# Altium project Assignment1.PrjPcb
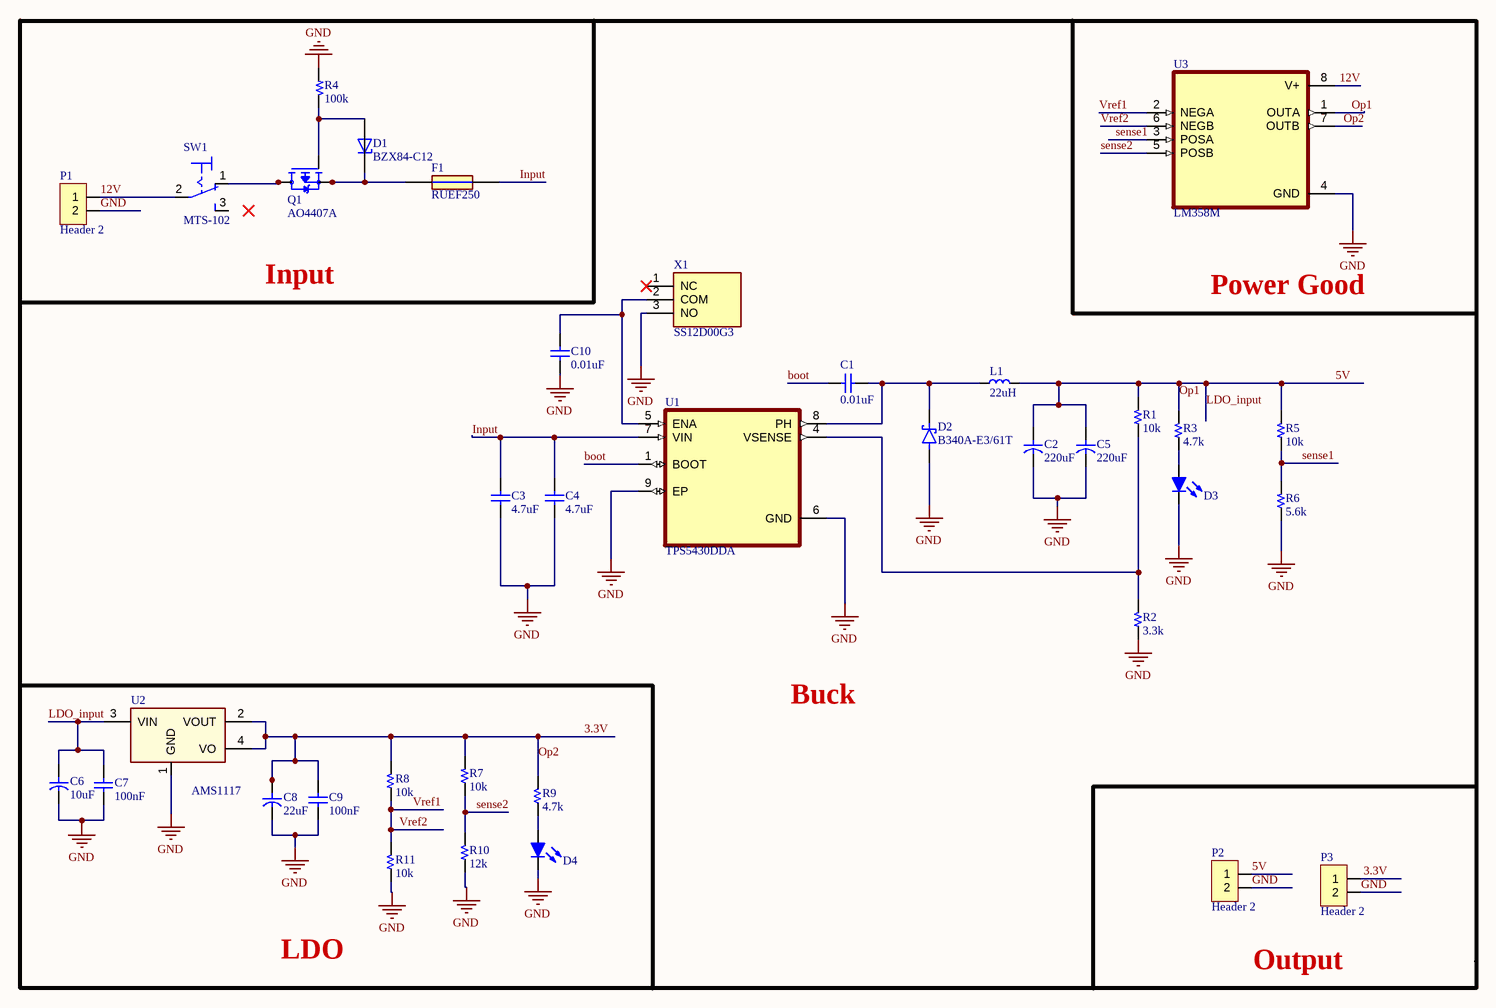
[diagram p0: Assignment1.SchDoc]
1 sheet, 36 parts. Net scope: global (net labels, ports and power ports of the same name join across sheets).
Board file: Assignment1.PcbDoc

## Sheet Assignment1.SchDoc
size 420 x 297 mm; SheetNumber: 1; SheetTotal: 1

### Parts
C1  0.01uF  [C 0805]
C2  220uF  [C SMD TAN 2917 (E)]
C3  4.7uF  [C 0805]
C4  4.7uF  [C 0805]
C5  220uF  [C SMD TAN 2917 (E)]
C6  10uF  [C SMD ALU (B)]
C7  100nF  [C 0805]
C8  22uF  [C SMD TAN 2917 (E)]
C9  100nF  [C 0805]
C10  0.01uF  [C 0805]
D1  BZX84-C12  [SOT95P230X110-3N]
D2  B340A-E3/61T  [DIOM5126X229N]
D3  Led  [LED 3MM - green]  (value not drawn)
D4  Led  [LED 3MM - green]  (value not drawn)
F1  RUEF250  [RUEF250]
L1  22uH  [Inductor SMD 12x12x8]
P1  Header 2  [HDR/Terminal/2]
P2  Header 2  [HDR/Terminal/2]
P3  Header 2  [HDR/Terminal/2]
Q1  AO4407A  [SOIC127P600X175-8N]
R1  10k  [R 1206]
R2  3.3k  [R 1206]
R3  4.7k  [R 1206]
R4  100k  [R 1206]
R5  10k  [R 1206]
R6  5.6k  [R 1206]
R7  10k  [R 1206]
R8  10k  [R 1206]
R9  4.7k  [R 1206]
R10  12k  [R 1206]
R11  10k  [R 1206]
SW1  MTS-102  [MTS-102]
U1  TPS5430DDA  [VREG_LM5017MR/NOPB]
U2  AMS1117  [SOT-223]
U3  LM358M  [SOIC127P599X175-8N]
X1  SS12D00G3  [SS12D00G3]

### Nets
GND: C2.2 C3.2 C4.2 C5.2 C6.2 C7.2 C8.2 C9.2 C10.1 D2.A D3.2(K) D4.2(K) P1.2 P2.2 P3.2 R2.1 R4.1 R6.1 R10.1 R11.1 U1.6(GND) U1.9(EP) U2.1(GND) U3.4(GND) X1.3(NO)
3.3V: C8.1 C9.1 P3.1 R7.2 R8.2 R9.2 U2.2(VOUT) U2.4(VO) U3.7(OUTB)  [also labelled Op2]
5V: C2.1 C5.1 C6.1 C7.1 L1.2 P2.1 R1.2 R3.2 R5.2 U2.3(VIN) U3.1(OUTA)  [also labelled LDO_input, Op1]
12V: P1.1 SW1.2(P) U3.8(V+)
boot: C1.1 U1.1(BOOT)
Input: C3.1 C4.1 F1.2 U1.7(VIN)
sense1: R5.1 R6.2 U3.3(POSA)
sense2: R7.1 R10.2 U3.5(POSB)
Vref1: R8.1 R11.2 U3.2(NEGA) U3.6(NEGB)  [also labelled Vref2]
NetC1_2: C1.2 D2.C L1.1 U1.8(PH)
NetC10_2: C10.2 U1.5(ENA) X1.2(COM)
NetD1_1: D1.1(A) Q1.4(G) R4.2
NetD1_3: D1.3(C) F1.1 Q1.1(S) Q1.2(S) Q1.3(S)
NetD3_1: D3.1(A) R3.1
NetD4_1: D4.1(A) R9.1
NetQ1_5: Q1.5(D) Q1.6(D) Q1.7(D) Q1.8(D) SW1.1(O)
NetR1_1: R1.1 R2.2 U1.4(VSENSE)

Not connected (* = marked no-connect by the designer): SW1 3(S); X1 1(NC)*

### Notes on the sheet
- Input
- Power Good
- Buck
- LDO
- Output
- THIS DOCUMENT AND THE DATA DISCLOSED HEREIN OR
- HEREWITH IS THE PROPERTY OF ALTIUM LIMITED AND MAY
- DWG NO:
- REVISION
- REV:
- DESCRIPTION
- DATE
- APPROVED
- BE FREELY DISTRIBUTED IN WHOLE. NO RIGHTS ARE
- RESERVED OR EXPRESS OR IMPLIED WARANTEE GIVEN.
- ENG:
- APPROVALS
- PROJECT
- DSN:
- CHK:
- REFERENCE DOCUMENTS
- PROJECT REVISION:
- TITLE
- DOCUMENT REVISION:
- DESIGN ITEM:
- BOM:
- FAB DWG:
- PCB DWG:
- ASSY DWG:
- SCALE:
- A3
- SIZE
- CAGE CODE
- FILE NAME
- DWG NO.
- SHEET
- OF
- REV

### Library data of the parts
C1 C3 C4 C7 C9 C10 = Capacitor NP: Capacitor non-pol
C2 C5 C6 C8 = Capacitor: Capacitor pol
D1 = BZX84-C12: Zener Diode 12 V 250 mW Â±5% Surface Mount TO-236AB; MF: Nexperia USA; SnapEDA_Link: https://www.snapeda.com/parts/BZX84-C12/Nexperia/view-part/?ref=snap; Package: SOT-23 NXP Semiconductors; Value: *; MP: BZX84-C12; Check_prices: https://www.snapeda.com/parts/BZX84-C12/Nexperia/view-part/?ref=eda
D2 = B340A-E3/61T: Diode Schottky 40 V 3A Surface Mount DO-214AC (SMA); MF: Vishay Semiconductor; SnapEDA_Link: https://www.snapeda.com/parts/B340A-E3/61T/Vishay/view-part/?ref=snap; Package: DO-214 Vishay Semiconductor; Value: *; MP: B340A-E3/61T; Check_prices: https://www.snapeda.com/parts/B340A-E3/61T/Vishay/view-part/?ref=eda
D3 D4 = Led: Typical LED
F1 = RUEF250: Littelfuse 2.5A Radial Leaded PCB Mount Resettable Fuse, 30V dc; Geometry.Height: 18.3mm; Manufacturer_Name: LITTELFUSE; Manufacturer_Part_Number: RUEF250; Mouser Part Number: 650-RUEF250; Mouser Price/Stock: https://www.mouser.co.uk/ProductDetail/Littelfuse/RUEF250?qs=hv6pn79dJPQsHwuAgSfH9w%3D%3D; Arrow Part Number: RUEF250; Arrow Price/Stock: https://www.arrow.com/en/products/ruef250/littelfuse?utm_currency=USD&region=europe; Datasheet Link: https://www.littelfuse.com/~/media/electronics/product_specifications/resettable_ptcs/littelfuse_ptc_ruef250_product_specification.pdf.pdf
L1 = Inductor
P1-P3 = Header 2: Header, 2-Pin
Q1 = AO4407A: P-Channel 30 V 12A (Ta) 3.1W (Ta) Surface Mount 8-SOIC; MF: Alpha &; SnapEDA_Link: https://www.snapeda.com/parts/AO4407A/Alpha/view-part/?ref=snap; Package: SOIC-8 Alpha &amp; Omega Semiconductor; Value: *; MP: AO4407A; Check_prices: https://www.snapeda.com/parts/AO4407A/Alpha/view-part/?ref=eda
R1-R11 = Resistor
SW1 = MTS-102: Rectangular Cable Assemblies .100 Mini Mate Single Row Discrete Wire Cable Assembly, Terminal; MF: Motorola; MP: MTS102; Availability: Unavailable; Value: *; Package: None; SnapEDA_Link: https://www.snapeda.com/parts/MTS102/Motorola/view-part/698799/?ref=snap; Price: None; Check_prices: https://www.snapeda.com/parts/MTS102/Motorola/view-part/698799/?ref=eda
U1 = TPS5430DDA: 5.5V to 36V Input, 3A, 500kHz Step-Down Converter; MF: Texas Instruments; SnapEDA_Link: https://www.snapeda.com/parts/TPS5430DDA/Texas+Instruments/view-part/?ref=snap; Package: HSOIC-8 Texas Instruments; Value: *; MP: TPS5430DDA; Check_prices: https://www.snapeda.com/parts/TPS5430DDA/Texas+Instruments/view-part/?ref=eda
U2 = AMS1117: 1A LDO Voltage Regulator, ADJ or fixed 1.5/1.8/2.5/2.85/3.3/5V
U3 = LM358M: Op Amp Dual Low Power Amplifier Â±16V/32V 8-Pin SOIC Tube; MF: onsemi; SnapEDA_Link: https://www.snapeda.com/parts/LM358M/Onsemi/view-part/?ref=snap; Package: SOIC-8 ON Semiconductor; Value: *; MP: LM358M; Check_prices: https://www.snapeda.com/parts/LM358M/Onsemi/view-part/?ref=eda
X1 = SS12D00G3: 3 Pin Toggle Switch; Manufacturer_Name: Vimex; Geometry.Height: 7mm; Manufacturer_Part_Number: SS12D00G3; Mouser Part Number: *; Mouser Price/Stock: *; Arrow Part Number: *; Arrow Price/Stock: *; Datasheet Link: http://vimex.com/switches/techdocs/SS12D00-tech.pdf